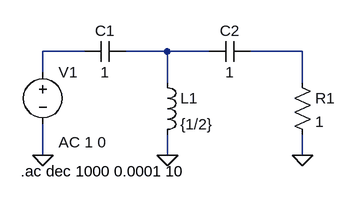
[diagram p0: schematic Draft2.asc]
Draft2.asc, the LTspice schematic file:
Version 4
SHEET 1 880 680
WIRE 32 112 -32 112
WIRE 160 112 96 112
WIRE 224 112 160 112
WIRE 368 112 288 112
WIRE -32 144 -32 112
WIRE 160 160 160 112
WIRE 368 160 368 112
WIRE -32 272 -32 224
WIRE 160 272 160 240
WIRE 368 272 368 240
FLAG 160 272 0
FLAG -32 272 0
FLAG 368 272 0
SYMBOL cap 96 96 R90
WINDOW 0 0 32 VBottom 2
WINDOW 3 32 32 VTop 2
SYMATTR InstName C1
SYMATTR Value 1
SYMBOL cap 288 96 R90
WINDOW 0 0 32 VBottom 2
WINDOW 3 32 32 VTop 2
SYMATTR InstName C2
SYMATTR Value 1
SYMBOL ind 144 144 R0
SYMATTR InstName L1
SYMATTR Value {1/2}
SYMBOL voltage -32 128 R0
WINDOW 123 24 124 Left 2
WINDOW 39 0 0 Left 0
SYMATTR InstName V1
SYMATTR Value ""
SYMATTR Value2 AC 1 0
SYMBOL res 352 144 R0
SYMATTR InstName R1
SYMATTR Value 1
TEXT -66 296 Left 2 !.ac dec 1000 0.0001 10

The netlist it stands for:
* Draft2.asc
C1 N002 N001 1
C2 N003 N002 1
L1 N002 0 {1/2}
V1 N001 0 AC 1 0
R1 N003 0 1
.ac dec 1000 0.0001 10
.backanno
.end